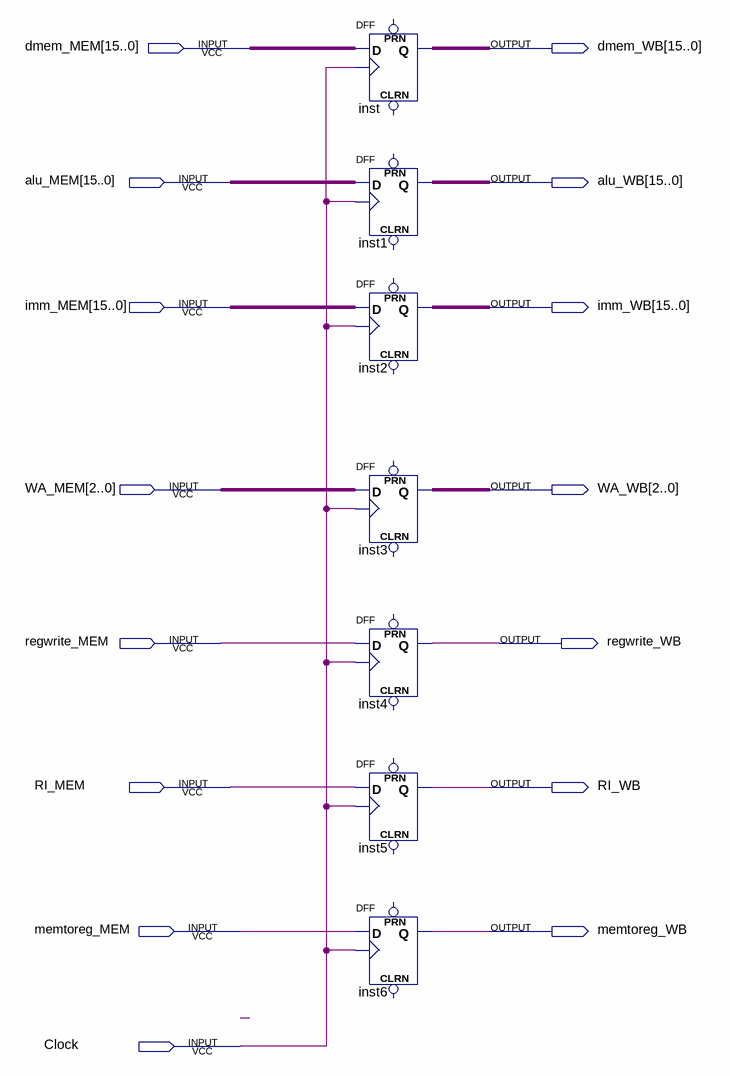
[diagram p0: schematic sheet]
// Quartus schematic MEMWB.bdf as structural Verilog: 7 symbols, 15 pins
module MEMWB (
  input  [15:0] dmem_MEM,
  input  [15:0] alu_MEM,
  input  [15:0] imm_MEM,
  input  [2:0] WA_MEM,
  input  regwrite_MEM,
  input  RI_MEM,
  input  memtoreg_MEM,
  input  Clock,
  output [15:0] dmem_WB,
  output [15:0] alu_WB,
  output [15:0] imm_WB,
  output [2:0] WA_WB,
  output regwrite_WB,
  output RI_WB,
  output memtoreg_WB
);

  DFF inst[15:0] (.CLK(Clock), .D(dmem_MEM), .Q(dmem_WB));  // open: CLRN, PRN
  DFF inst1[15:0] (.CLK(Clock), .D(alu_MEM), .Q(alu_WB));  // open: CLRN, PRN
  DFF inst2[15:0] (.CLK(Clock), .D(imm_MEM), .Q(imm_WB));  // open: CLRN, PRN
  DFF inst3[2:0] (.CLK(Clock), .D(WA_MEM), .Q(WA_WB));  // open: CLRN, PRN
  DFF inst4 (.CLK(Clock), .D(regwrite_MEM), .Q(regwrite_WB));  // open: CLRN, PRN
  DFF inst5 (.CLK(Clock), .D(RI_MEM), .Q(RI_WB));  // open: CLRN, PRN
  DFF inst6 (.CLK(Clock), .D(memtoreg_MEM), .Q(memtoreg_WB));  // open: CLRN, PRN
endmodule
